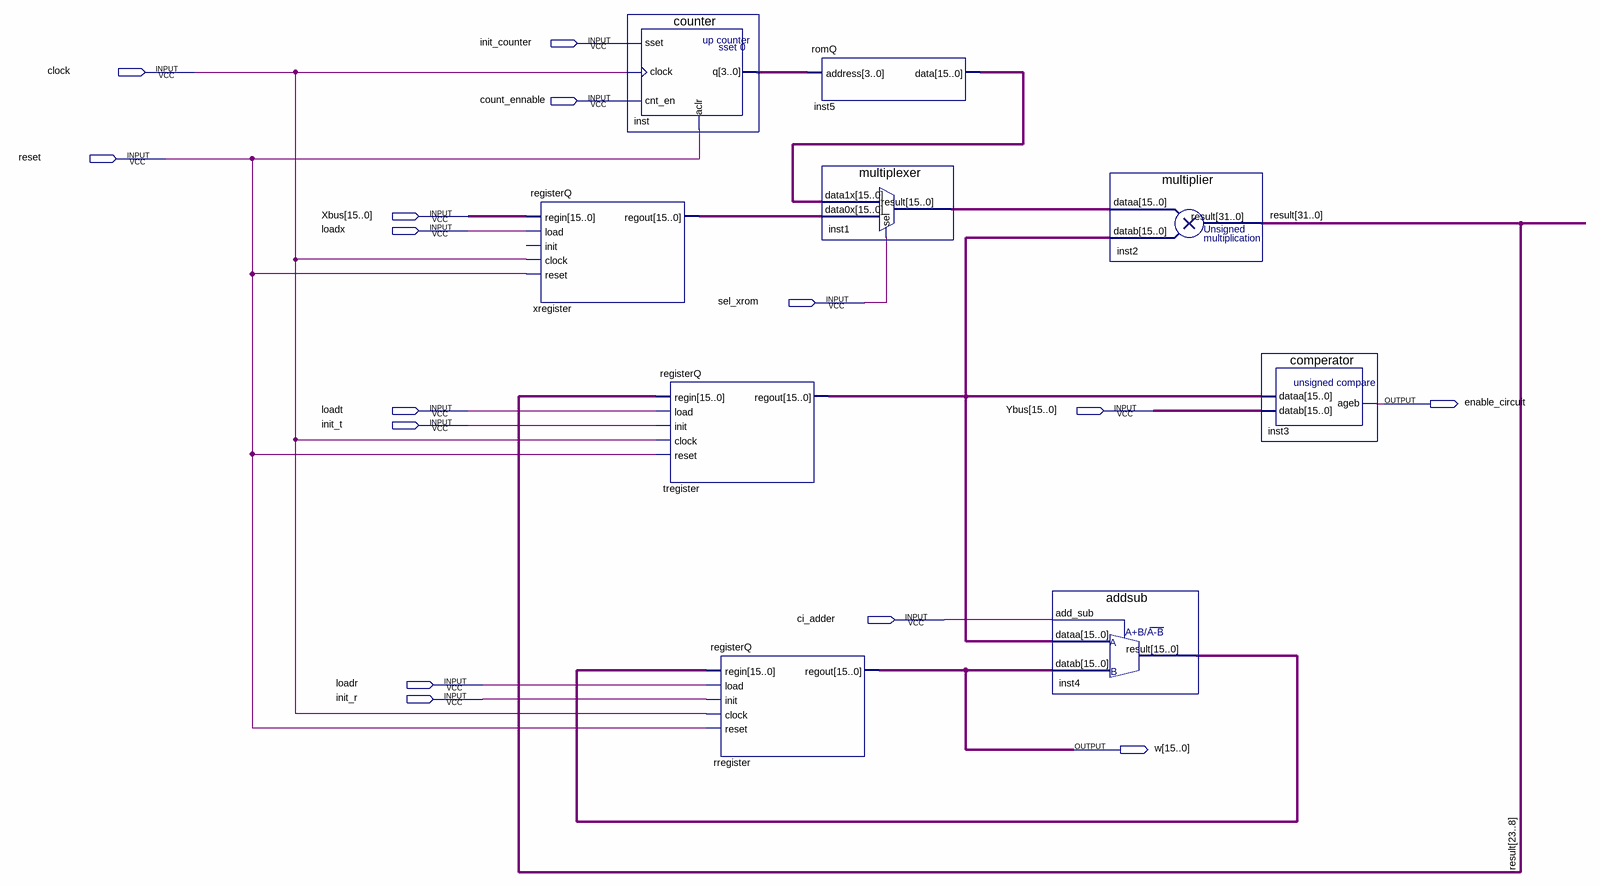
[diagram p0: schematic sheet]
// Quartus schematic datapathfinal.bdf as structural Verilog: 9 symbols, 15 pins
module datapathfinal (
  input  init_counter,
  input  clock,
  input  count_ennable,
  input  reset,
  input  [15:0] Xbus,
  input  loadx,
  input  sel_xrom,
  input  loadt,
  input  [15:0] Ybus,
  input  init_t,
  input  ci_adder,
  input  loadr,
  input  init_r,
  output enable_circuit,
  output [15:0] w
);

  wire [3:0] inst_q;
  wire [15:0] inst1_result, inst4_result, inst5_data, tregister_regout, xregister_regout;
  wire [31:0] result;

  registerQ xregister (
    .regin(Xbus), .load(loadx), .clock(clock), .reset(reset), .regout(xregister_regout));  // open: init
  counter inst (.sset(init_counter), .clock(clock), .cnt_en(count_ennable), .aclr(reset), .q(inst_q));
  registerQ tregister (
    .regin(result[23:8]), .load(loadt), .init(init_t), .clock(clock), .reset(reset), .regout(tregister_regout));
  registerQ rregister (.regin(inst4_result), .load(loadr), .init(init_r), .clock(clock), .reset(reset), .regout(w));
  romQ inst5 (.address(inst_q), .data(inst5_data));
  multiplexer inst1 (.data1x(inst5_data), .data0x(xregister_regout), .sel(sel_xrom), .result(inst1_result));
  addsub inst4 (.add_sub(ci_adder), .dataa(tregister_regout), .datab(w), .result(inst4_result));
  multiplier inst2 (.dataa(inst1_result), .datab(tregister_regout), .result(result));
  comperator inst3 (.dataa(tregister_regout), .datab(Ybus), .ageb(enable_circuit));
endmodule
